# EAGLE design main (EAGLE 7.5.0)
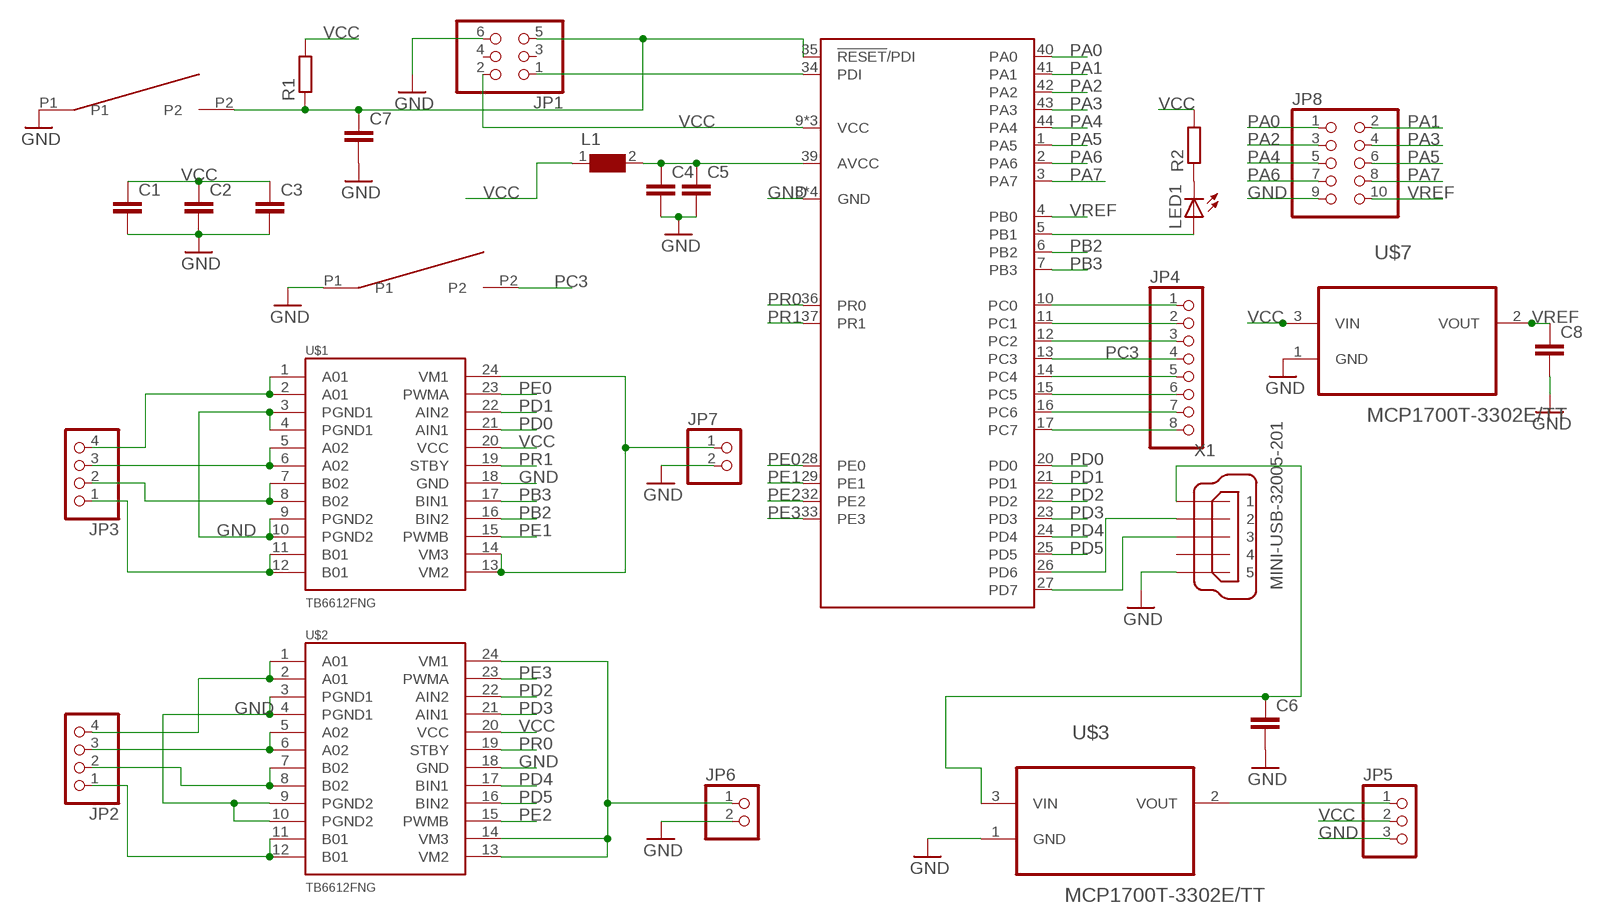
[diagram p0: schematic, sheet 1]

## Parts
C1  C-EUC0805  [C0805]
C2  C-EUC0805  [C0805]
C3  C-EUC0805  [C0805]
C4  C-EUC0805  [C0805]
C5  C-EUC0805  [C0805]
C6  C-EUC0805  [C0805]
C7  C-EUC0805  [C0805]
C8  C-EUC0805  [C0805]
JP1  PINHD-2X3  [2X03]
JP2  PINHD-1X4  [1X04]
JP3  PINHD-1X4  [1X04]
JP4  PINHD-1X8  [1X08]
JP5  PINHD-1X3  [1X03]
JP6  PINHD-1X2  [1X02]
JP7  PINHD-1X2  [1X02]
JP8  PINHD-2X5  [2X05]
L1  WE-CBF-74279202_0805  [0805]
LED1  LEDCHIP-LED0805  [CHIP-LED0805]
R1  R-EU_R0805  [R0805]
R2  R-EU_R0805  [R0805]
U1  ATXMEGA32C4-AU  [TQFP-44A-44]
U$1  TB6612FNG  [SSOP24]
U$2  TB6612FNG  [SSOP24]
U$3  MCP1700T-3302E/TT  [SOT95P237X112-3N]
U$4  SWITCH_2PIN_SMD  [SWITCH_2PIN_SMD]
U$6  SWITCH_2PIN_SMD  [SWITCH_2PIN_SMD]
U$7  MCP1700T-3302E/TT  [SOT95P237X112-3N]
X1  MINI-USB-32005-201  [32005-201]

## Nets
AO1_1: JP3.4 U$1.1(A01) U$1.2(A01)
AO1_2: JP2.4 U$2.1(A01) U$2.2(A01)
AO2_1: JP3.3 U$1.5(A02) U$1.6(A02)
AO2_2: JP2.3 U$2.5(A02) U$2.6(A02)
AVCC: C4.1 C5.1 L1.2 U1.39(AVCC)
BO1_1: JP3.1 U$1.11(B01) U$1.12(B01)
BO1_2: JP2.1 U$2.11(B01) U$2.12(B01)
BO2_1: JP3.2 U$1.7(B02) U$1.8(B02)
BO2_2: JP2.2 U$2.7(B02) U$2.8(B02)
GND: C1.2 C2.2 C3.2 C4.2 C5.2 C6.2 C7.2 C8.2 JP1.6 JP5.3 JP6.2 JP7.2 JP8.9 U1.8(GND) U1.18(GND) U1.30(GND) U1.38(GND) U$1.3(PGND1) U$1.4(PGND1) U$1.9(PGND2) U$1.10(PGND2) U$1.18(GND) U$2.3(PGND1) U$2.4(PGND1) U$2.9(PGND2) U$2.10(PGND2) U$2.18(GND) U$3.1(GND) U$4.P1 U$6.P1 U$7.1(GND) X1.5
N$1: JP1.1 U1.34(PDI)
N$2: LED1.C R2.1
N$3: C7.1 JP1.5 R1.1 U1.35(!RESET!/PDI) U$4.P2
N$4: JP4.6 U1.15(PC5)
N$5: JP4.5 U1.14(PC4)
N$6: U1.26(PD6) X1.2
N$7: U1.27(PD7) X1.3
N$8: C6.1 U$3.3(VIN) X1.1
N$12: JP5.1 U$3.2(VOUT)
N$18: LED1.A U1.5(PB1)
N$19: JP4.8 U1.17(PC7)
N$21: JP4.7 U1.16(PC6)
N$26: JP4.3 U1.12(PC2)
N$27: JP4.2 U1.11(PC1)
N$28: JP4.1 U1.10(PC0)
PA0: JP8.1 U1.40(PA0)
PA1: JP8.2 U1.41(PA1)
PA2: JP8.3 U1.42(PA2)
PA3: JP8.4 U1.43(PA3)
PA4: JP8.5 U1.44(PA4)
PA5: JP8.6 U1.1(PA5)
PA6: JP8.7 U1.2(PA6)
PA7: JP8.8 U1.3(PA7)
PB2: U1.6(PB2) U$1.16(BIN2)
PB3: U1.7(PB3) U$1.17(BIN1)
PC3: JP4.4 U1.13(PC3) U$6.P2
PD0: U1.20(PD0) U$1.21(AIN1)
PD1: U1.21(PD1) U$1.22(AIN2)
PD2: U1.22(PD2) U$2.22(AIN2)
PD3: U1.23(PD3) U$2.21(AIN1)
PD4: U1.24(PD4) U$2.17(BIN1)
PD5: U1.25(PD5) U$2.16(BIN2)
PE0: U1.28(PE0) U$1.23(PWMA)
PE1: U1.29(PE1) U$1.15(PWMB)
PE2: U1.32(PE2) U$2.15(PWMB)
PE3: U1.33(PE3) U$2.23(PWMA)
PR0: U1.36(PR0) U$2.19(STBY)
PR1: U1.37(PR1) U$1.19(STBY)
VCC: C1.1 C2.1 C3.1 JP1.2 JP5.2 L1.1 R1.2 R2.2 U1.9(VCC) U1.19(VCC) U1.31(VCC) U$1.20(VCC) U$2.20(VCC) U$7.3(VIN)
VCC_MOTOR2: JP6.1 U$2.13(VM2) U$2.14(VM3) U$2.24(VM1)
VCC_MOTOR_1: JP7.1 U$1.13(VM2) U$1.14(VM3) U$1.24(VM1)
VREF: C8.1 JP8.10 U1.4(PB0) U$7.2(VOUT)
Unconnected: JP1.3 JP1.4 X1.4

## Library data of the parts
C1-C8 = rcl:C-EU: CAPACITOR, European symbol
JP1 = pinhead:PINHD-2X3: PIN HEADER
JP2 JP3 = pinhead:PINHD-1X4: PIN HEADER
JP4 = pinhead:PINHD-1X8: PIN HEADER
JP5 = pinhead:PINHD-1X3: PIN HEADER
JP6 JP7 = pinhead:PINHD-1X2: PIN HEADER
JP8 = pinhead:PINHD-2X5: PIN HEADER
L1 = WE-CBF:WE-CBF: SMD EMI Suppression Ferrite Beads WE-CBF - Excellent anti-EMI properties - Low DC-restistance - Impedances till 3000 ohms - Rated current up to 6 A -- Reliable Ni-Sn electrodes -- Perfect as data lined filter and for uncoupling of distribution voltage; MPN: 74279202; OC_FARNELL: 1635711; OC_NEWARK: 08P2361; PACKAGE: IND-0805; SUPPLIER: Wuerth Elektronik
LED1 = led:LED: LED OSRAM: - CHIPLED LG R971, LG N971, LY N971, LG Q971, LY Q971, LO R971, LY R971 LH N974, LH R974 LS Q976, LO Q976, LY Q976 LO Q996 - Hyper CHIPLED LW Q18S LB Q993, LB Q99A, LB R99A - SideLED LS A670, LO A670, LY A670, LG A670, LP A670 LB A673, LV A673, LT A673, LW A673 LH A674 LY A675 LS A676, LA A676, LO A676, LY A676, LW A676 LS A679, LY A679, LG A679 - Hyper Micro SIDELED® LS Y876, LA Y876, LO Y876, LY Y876 LT Y87S - SmartLED LW L88C, LW L88S LB L89C, LB L89S, LG L890 LS L89K, LO L89K, LY L89K LS L896, LA L896, LO L896, LY L896 - TOPLED LS T670, LO T670, LY T670, LG T670, LP T670 LSG T670, LSP T670, LSY T670, LOP T670, LYG T670 LG T671, LOG T671, LSG T671 LB T673, LV T673, LT T673, LW T673 LH T674 LS T676, LA T676, LO T676, LY T676, LB T676, LH T676, LSB T676, LW T676 LB T67C, LV T67C, LT T67C, LS T67K, LO T67K, LY T67K, LW E67C LS E67B, LA E67B, LO E67B, LY E67B, LB E67C, LV E67C, LT E67C LW T67C LS T679, LY T679, LG T679 LS T770, LO T770, LY T770, LG T770, LP T770 LB T773, LV T773, LT T773, LW T773 LH T774 LS E675, LA E675, LY E675, LS T675 LS T776, LA T776, LO T776, LY T776, LB T776 LHGB T686 LT T68C, LB T68C - Hyper Mini TOPLED® LB M676 - Mini TOPLED Santana® LG M470 LS M47K, LO M47K, LY M47K Source: http://www.osram.convergy.de LUXEON: - LUMILED® LXK2-PW12-R00, LXK2-PW12-S00, LXK2-PW14-U00, LXK2-PW14-V00 LXK2-PM12-R00, LXK2-PM12-S00, LXK2-PM14-U00 LXK2-PE12-Q00, LXK2-PE12-R00, LXK2-PE12-S00, LXK2-PE14-T00, LXK2-PE14-U00 LXK2-PB12-K00, LXK2-PB12-L00, LXK2-PB12-M00, LXK2-PB14-N00, LXK2-PB14-P00, LXK2-PB14-Q00 LXK2-PR12-L00, LXK2-PR12-M00, LXK2-PR14-Q00, LXK2-PR14-R00 LXK2-PD12-Q00, LXK2-PD12-R00, LXK2-PD12-S00 LXK2-PH12-R00, LXK2-PH12-S00 LXK2-PL12-P00, LXK2-PL12-Q00, LXK2-PL12-R00 Source: www.luxeon.com KINGBRIGHT: KA-3528ASYC Source: www.kingbright.com
R1 R2 = resistor:R-EU_: RESISTOR, European symbol
U1 = atmega-atxmega:ATXMEGA32C4: 8/16-bit XMEGA C4 Microcontroller Features High-performance, low-power Atmel® AVR® XMEGA® 8/16-bit Microcontroller Nonvolatile program and data memories – 16K - 32KBytes of In-System Self-Programmable Flash – 4KBytes Boot Code Section with Independent Lock Bits – 1KBytes EEPROM – 2K - 4KBytes Internal SRAM Peripheral features – Four-channel event system – Four 16-bit timer/counters Three timer/counters with four output compare or input capture channels One timer/counter with two output compare or input capture channels High resolution extension on two timer/counters Advanced waveform extension (AWeX) on one timer/counter – One USB device interface USB 2.0 full speed (12Mbps) and low speed (1.5Mbps) device compliant 32 Endpoints with full configuration flexibility – Three USARTs with IrDA support for one USART – Two two-wire interfaces with dual address match (I2C and SMBus compatible) – Two serial peripheral interfaces (SPIs) – CRC-16 (CRC-CCITT) and CRC-32 (IEEE®802.3) generator – 16-bit real time counter (RTC) with separate oscillator – One sixteen-channel, 12-bit, 300ksps Analog to Digital Converter – Two Analog Comparators with window compare function, and current sources – External interrupts on all general purpose I/O pins – Programmable watchdog timer with separate on-chip ultra low power oscillator – QTouch® library support Capacitive touch buttons, sliders and wheels Special microcontroller features – Power-on reset and programmable brown-out detection – Internal and external clock options with PLL and prescaler – Programmable multilevel interrupt controller – Five sleep modes – Programming and debug interface PDI (program and debug interface) I/O and packages – 34 programmable I/O pins – 44-lead TQFP – 44-pad QFN – 49-ball VFBGA Operating voltage – 1.6 – 3.6V Operating frequency – 0 – 12MHz from 1.6V – 0 – 32MHz from 2.7V
U$1 U$2 = SparkFun-PowerIC:TB6612FNG: Toshiba 1A dual motor driver IC-09363; PROD_ID: IC-09363
U$3 U$7 = microchip_ldo:MCP1700T-3302E/TT: Low Quiescent Current LDO; MPN: MCP1700T-3302E/TT; OC_FARNELL: 1296592; OC_NEWARK: 88H9817; PACKAGE: SOT23-3; SUPPLIER: Microchip
U$4 U$6 = emile:SWITCH_2PIN_SMD
X1 = con-cypressindustries:MINI-USB-: MINI USB-B Conector Source: www.cypressindustries.com; OC_FARNELL: unknown; OC_NEWARK: unknown

## Board
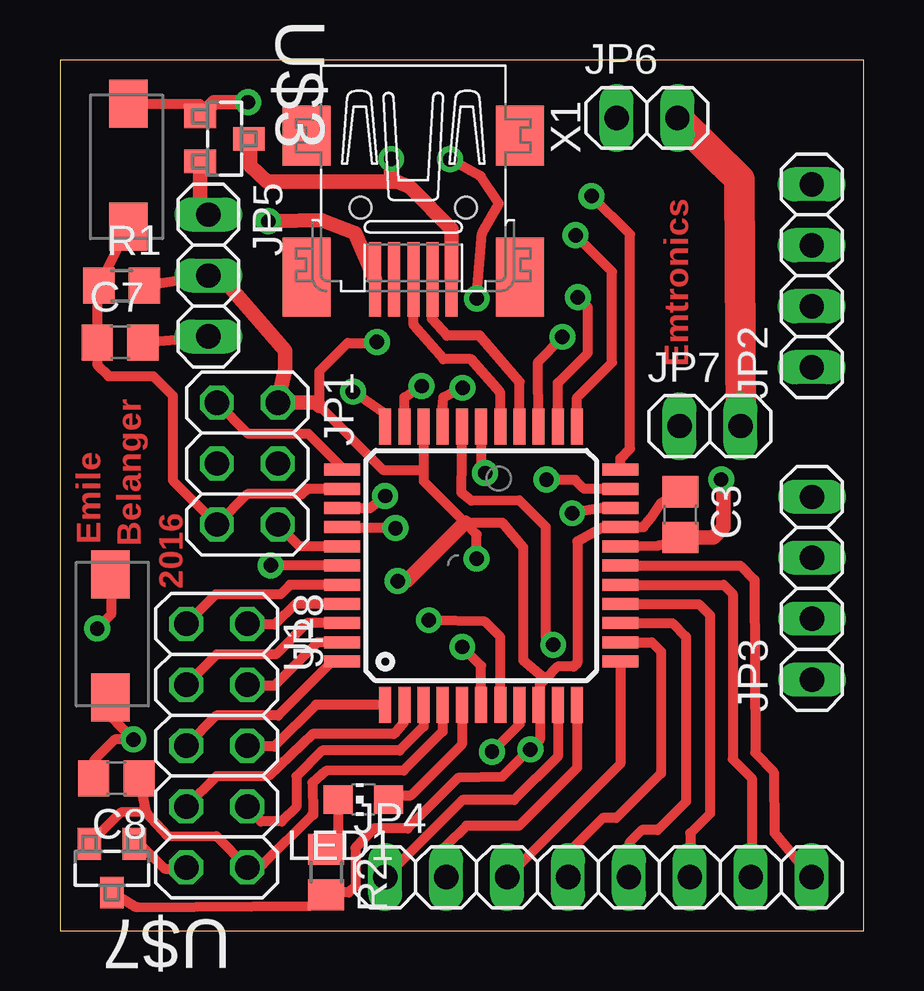
[diagram p1: board, top side]
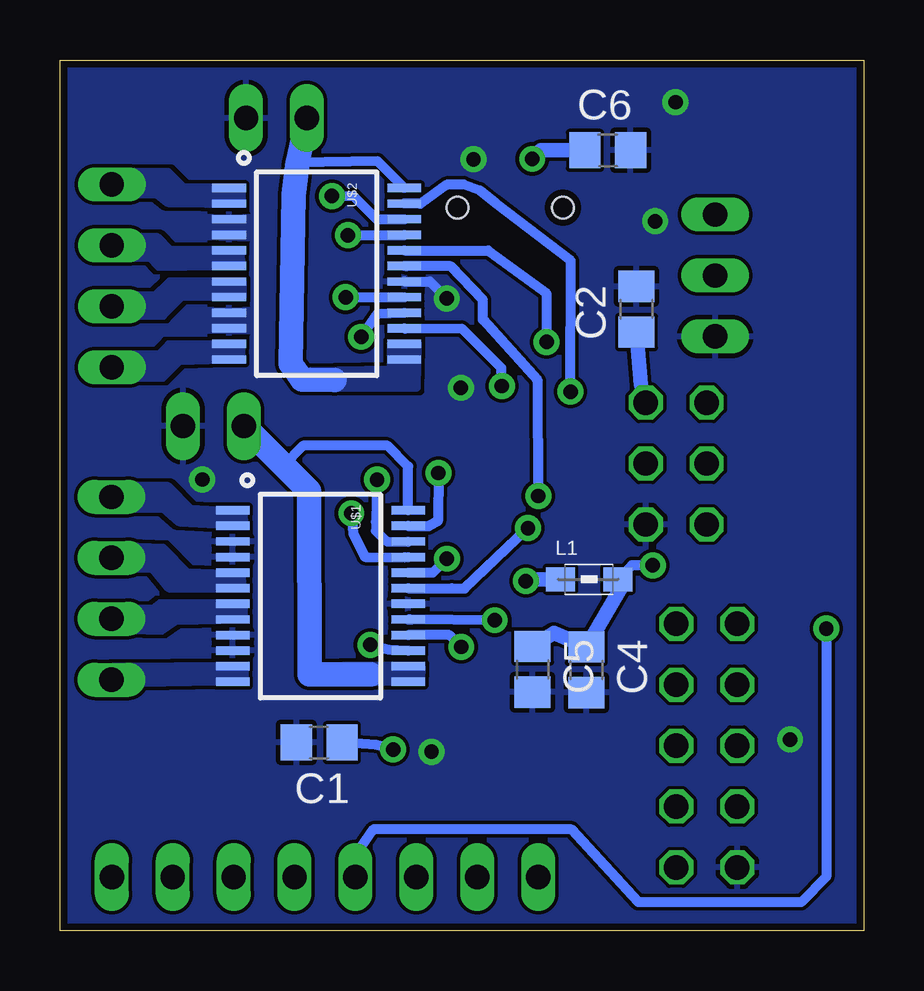
[diagram p2: board, bottom side, seen from below]

Size 33.5 x 36.3 mm. Coordinates in mm from the lower left corner, seen from the top.
Outline: 0,0 33.5,0 33.5,36.3 0,36.3 0,0
Copper layers (1*16): Top 0.035mm / dielectric 1.5mm / Bottom 0.035mm
Design rules "PCB-POOL Standard": minimum track width 0.15mm, minimum drill 0.3mm, track to track 0.15mm, track to pad 0.15mm, pad to pad 0.15mm, via to via 0.15mm, smd to smd 0.15mm, copper to edge 0.3mm, drill to drill 0.2mm, minimum pad ring 0.2mm, minimum via ring 0.15mm, stop-mask expansion 0.075mm, vias tented up to drill 0mil, thermal gap 0.2mm

### Footprints (pad centres in the part's own frame; a part is rotated, then mirrored left to right if it is on the bottom)
C0805 = smd 1.3 x 1.5: 1 -0.95,0; 2 0.95,0
2X03 = drill 1.016 octagon: 1 -2.54,-1.27; 2 -2.54,1.27; 3 0,-1.27; 4 0,1.27; 5 2.54,-1.27; 6 2.54,1.27
1X04 = drill 1.016 long: 1 -3.81,0; 2 -1.27,0; 3 1.27,0; 4 3.81,0
1X08 = drill 1.016 long: 1 -8.89,0; 2 -6.35,0; 3 -3.81,0; 4 -1.27,0; 5 1.27,0; 6 3.81,0; 7 6.35,0; 8 8.89,0
1X03 = drill 1.016 long: 1 -2.54,0; 2 0,0; 3 2.54,0
1X02 = drill 1.016 long: 1 -1.27,0; 2 1.27,0
2X05 = drill 1.016 octagon: 1 -5.08,-1.27; 2 -5.08,1.27; 3 -2.54,-1.27; 4 -2.54,1.27; 5 0,-1.27; 6 0,1.27; 7 2.54,-1.27; 8 2.54,1.27; 9 5.08,-1.27; 10 5.08,1.27
0805 = smd 1.2 x 1: 1 -1.2,0; 2 1.2,0
CHIP-LED0805 = smd 1.2 x 1.2: A 0,-1.05; C 0,1.05
R0805 = smd 1.3 x 1.5: 1 -0.95,0; 2 0.95,0
TQFP-44A-44 = smd 1.5 x 0.5: 1 -5.8,4; 2 -5.8,3.2; 3 -5.8,2.4; 4 -5.8,1.6; 5 -5.8,0.8; 6 -5.8,0; 7 -5.8,-0.8; 8 -5.8,-1.6; 9 -5.8,-2.4; 10 -5.8,-3.2; 11 -5.8,-4; 23 5.8,-4; 24 5.8,-3.2; 25 5.8,-2.4; 26 5.8,-1.6; 27 5.8,-0.8; 28 5.8,0; 29 5.8,0.8; 30 5.8,1.6; 31 5.8,2.4; 32 5.8,3.2; 33 5.8,4 | smd 0.5 x 1.5: 12 -4,-5.8; 13 -3.2,-5.8; 14 -2.4,-5.8; 15 -1.6,-5.8; 16 -0.8,-5.8; 17 0,-5.8; 18 0.8,-5.8; 19 1.6,-5.8; 20 2.4,-5.8; 21 3.2,-5.8; 22 4,-5.8; 34 4,5.8; 35 3.2,5.8; 36 2.4,5.8; 37 1.6,5.8; 38 0.8,5.8; 39 0,5.8; 40 -0.8,5.8; 41 -1.6,5.8; 42 -2.4,5.8; 43 -3.2,5.8; 44 -4,5.8
SSOP24 = smd 0.348 x 1.397: 1 -3.575,-3.656; 2 -2.925,-3.656; 3 -2.275,-3.656; 4 -1.625,-3.656; 5 -0.975,-3.656; 6 -0.325,-3.656; 7 0.325,-3.656; 8 0.975,-3.656; 9 1.625,-3.656; 10 2.275,-3.656; 11 2.925,-3.656; 12 3.575,-3.656; 13 3.575,3.656; 14 2.925,3.656; 15 2.275,3.656; 16 1.625,3.656; 17 0.975,3.656; 18 0.325,3.656; 19 -0.325,3.656; 20 -0.975,3.656; 21 -1.625,3.656; 22 -2.275,3.656; 23 -2.925,3.656; 24 -3.575,3.656
SOT95P237X112-3N = smd 0.991 x 1.321: 1 -0.94,-1.016; 2 0.94,-1.016; 3 0,1.016
SWITCH_2PIN_SMD = smd 2 x 1.6: P1 -2.631,0.075; P2 2.484,0.075
32005-201 = smd 3.1 x 0.5: 1 3,1.6; 2 3,0.8; 3 3,0; 4 3,-0.8; 5 3,-1.6 | smd 2.5 x 2: M1 -3,-4.45; M2 -3,4.45 | smd 3.3 x 2: M3 2.9,4.45; M4 2.9,-4.45 | hole 0.9: 0,2.2; 0,-2.2

### Placement (x,y rotation side)
C1  22.7,7.84 180 bottom
C2  9.47,25.91 90 bottom
C3  25.86,17.35 270 top
C4  11.55,10.88 270 bottom
C5  13.79,10.9 270 bottom
C6  10.66,32.53 0 bottom
C7  2.51,24.52 0 top
C8  2.36,6.36 180 top
JP1  7.81,19.48 270 top
JP2  31.34,27.3 90 top
JP3  31.35,14.27 90 top
JP4  22.45,2.24 0 top
JP5  6.19,27.31 270 top
JP6  24.47,33.88 0 top
JP7  27.1,21.04 0 top
JP8  6.54,7.72 270 top
L1  11.44,14.65 0 bottom
LED1  12.65,5.47 90 top
R1  2.57,26.89 0 top
R2  11.1,2.44 270 top
U1  17.56,15.22 90 top
U$1  22.64,13.95 270 bottom
U$2  22.79,27.39 270 bottom
U$3  6.86,33.01 270 top
U$4  2.78,31.84 270 top
U$6  2.18,12.36 90 top
U$7  2.17,2.61 180 top
X1  14.73,30.15 270 top

### Tracks (layer width: path | path; a pad name or v marks a point on that pad's centre or on a via)
AO1_1
  pour Bottom (no thermals): 26.6,17.46 28.04,17.54 28.99,18.49 31.11,18.49 31.11,17.65 29.18,17.65 28.52,17.06 25.84,16.92 25.86,17.46
AO1_2
  pour Bottom (no thermals): 26.48,30.93 28.34,30.93 29,31.58 31.28,31.58 31.33,30.76 29.43,30.73 29,30.38 25.94,30.33 25.96,30.88
AO2_1
  pour Bottom (no thermals): 25.95,14.82 28.21,14.9 29.2,15.92 31.22,16 31.16,15.15 29.64,15.12 28.97,14.31 25.9,14.3 25.95,14.72
AO2_2
  pour Bottom (no thermals): 26.73,28.33 28.93,28.36 29.43,28.86 31.43,28.86 31.43,28.11 29.72,28.09 29.35,27.71 25.97,27.77 25.99,28.31
AVCC  (via drill 0.6)
  Top 0.406: U1.39 v8.8,15.22 v8.79,15.23
  Bottom 0.406: v8.79,15.23 9.66,15.23 L1.2
  Bottom 0.61: L1.2 10.03,14.45 C4.1 12.91,12.41 C5.1
BO1_1
  pour Bottom (no thermals): 25.82,10.95 25.86,10.45 31.25,10.34 31.21,10.98 26.27,11.01
BO1_2
  pour Bottom (no thermals): 26.63,23.83 28.56,23.76 29.25,23.07 31.03,23.07 31.03,24 29.35,24 28.93,24.42 25.99,24.42 25.99,23.88
BO2_1
  pour Bottom (no thermals): 26.62,13.6 29.28,13.63 29.6,13.37 31.17,13.41 31.16,12.6 29.28,12.53 28.68,12.96 25.87,13.03 25.87,13.63
BO2_2
  pour Bottom (no thermals): 26.51,26.45 28.44,26.45 29.23,25.66 31.03,25.66 31.03,26.45 29.5,26.45 28.91,27.03 25.92,27.03 25.92,26.43
GND  (via drill 0.6)
  Top 0.406: U1.18 24.98,16.06 C3.2 | U1.8 19.16,8.61 v18.01,7.46 | U1.30 15.96,21.78 15.98,22.23 v16.78,22.63 | v17.37,26.36 17.6,29.07 18.3,30.32 17.54,31.46 v16.26,32.16 | U1.38 9.99,16.02 JP1.6 | U$4.P1 5.84,34.47 U$3.1 | C7.2 JP5.3 | U$6.P1 2.13,8.94 v3.06,7.97 2.29,7.97 1.44,7.12 1.44,6.39 C8.2 1.51,6.46 | U$7.1 3.43,3.52 4.36,2.59 5.22,2.59 JP8.9
  Top 0.61: X1.5 12.3,29.08 10.91,29.61 8.92,29.58 v8.69,29.58 | U$3.1 6.43,34.54 v7.83,34.54 | C3.2 27.24,16.4 27.65,16.81 27.65,18.73 v27.57,18.81
  Top 1.27: 28.39,21.02 28.32,31.33 25.8,33.82 25.75,33.87 JP6.2
  Bottom 0.406: U$2.18 18.08,27.06 v17.37,26.36
  Bottom 0.61: v7.83,34.54 7.87,34.57
  pour Bottom (rank 2): 35.94,37.66 -2.01,38.08 -2.3,-3.39 35.36,-3.51
  pour Bottom (no thermals): 26.48,25.77 27.67,25.81 27.64,25.11 25.32,25.06 25.29,25.81
  pour Bottom (no thermals): 26.48,29.65 27.67,29.69 27.64,28.99 25.32,28.94 25.29,29.69
N$1
  Top 0.406: U1.34 11.76,19.31 10.36,20.71 7.85,20.71 JP1.1
N$2
  Top 0.406: LED1.C 11.6,4.02 R2.1
N$3
  Top 0.406: U1.35 10.29,18.42 10.08,18.2 7.81,18.2 JP1.5 4.71,18.77 4.71,22.3 3.89,23.12 2.03,23.12 1.56,23.59 C7.1 1.56,26.89 R1.1 U$4.P2
N$4
  Top 0.406: U1.15 26.63,13.62 27.09,13.16 27.09,4.88 26.28,4.07 26.28,2.25 JP4.6
N$5
  Top 0.406: U1.14 25.53,12.82 26.1,12.25 26.1,5.38 24.92,4.2 24.26,4.2 23.74,3.68 23.74,2.26 JP4.5
N$6
  Top 0.406: U1.26 19.16,22.87 17.49,24.81 16.12,24.8 15.5,25.5 15.49,27.11 X1.2
N$7
  Top 0.406: U1.27 18.36,22.43 17.14,23.83 15.99,23.83 14.75,25.24 X1.3
N$8  (via drill 0.6)
  Top 0.61: X1.1 16.33,29.25 14.58,30.99 14.04,31.23 | 14.04,31.23 8.63,31.23 7.92,31.89 7.92,32.97 U$3.3 | v13.81,32.17 13.81,31.42 14.04,31.23
  Bottom 0.61: C6.1 13.45,32.53 v13.81,32.17
N$12
  Top 0.61: U$3.2 5.84,30.2 JP5.1
N$18
  Top 0.406: U1.5 16.76,7.77 14.61,5.63 13.86,5.63 LED1.A
N$19
  Top 0.406: U1.17 28.36,15.22 28.95,14.63 28.98,7.42 29.75,6.62 29.79,4.08 31.08,2.49 JP4.8
N$21
  Top 0.406: U1.16 27.67,14.42 28.05,14.04 28.05,7.15 28.84,6.36 28.84,2.28 JP4.7
N$26
  Top 0.406: U1.12 23.36,6.95 JP4.3
N$27
  Top 0.406: U1.11 21.56,6.8 19.14,4.38 16.94,4.38 16.1,3.54 JP4.2
N$28
  Top 0.406: U1.10 20.76,7.27 18.94,5.45 16.77,5.45 JP4.1
PA0
  Top 0.406: U1.40 9.59,14.42 9.19,14.03 6.5,14.03 JP8.1
PA1
  Top 0.406: U1.41 9.81,13.62 8.96,12.76 7.84,12.76 JP8.2
PA2
  Top 0.406: U1.42 10.3,12.82 9,11.52 6.53,11.52 JP8.3
PA3
  Top 0.406: U1.43 10.74,12.02 8.93,10.21 7.85,10.21 JP8.4
PA4
  Top 0.406: U1.44 11.35,11.22 9.1,8.97 6.52,8.97 JP8.5
PA5
  Top 0.406: U1.1 10.67,9.42 8.93,7.68 7.84,7.68 JP8.6
PA6
  Top 0.406: U1.2 14.36,8.74 13.92,8.21 10.53,8.21 8.67,6.44 6.53,6.44 JP8.7
PA7
  Top 0.406: U1.3 15.16,8.51 14.16,7.51 10.94,7.51 9.86,6.44 9.86,5.17 9.24,4.55 8.38,4.55 JP8.8
PB2  (via drill 0.6)
  Top 0.406: U1.6 17.56,11.05 v16.77,11.83
  Bottom 0.406: v16.77,11.83 17.26,12.33 U$1.16
PB3  (via drill 0.6)
  Top 0.406: U1.7 18.36,12.25 17.71,12.89 v15.37,12.95
  Bottom 0.406: v15.37,12.95 18.86,12.97 U$1.17
PC3  (via drill 0.6)
  Top 0.406: U1.13 24.67,12.02 25.06,11.64 25.06,6.56 23.2,4.7 22.63,4.7 21.2,3.27 21.2,2.26 JP4.4 | U$6.P2 2.13,13.18 v1.55,12.6
  Bottom 0.406: v1.55,12.6 1.55,2.24 2.6,1.2 9.39,1.2 12.17,4.23 20.44,4.23 21.2,3.15 21.2,2.26 JP4.4
PD0  (via drill 0.6)
  Top 0.406: U1.20 22.57,17.62 v21.35,17.41
  Bottom 0.406: v21.35,17.41 21.27,16.55 20.78,15.59 19.13,15.57 U$1.21
PD1  (via drill 0.6)
  Top 0.406: U1.21 21.85,18.42 21.47,18.8 20.29,18.8 v20.28,18.81
  Bottom 0.406: v20.28,18.81 20.33,17.04 20.33,16.67 19.88,16.23 19,16.21 U$1.22
PD2  (via drill 0.6)
  Top 0.406: U1.22 23.36,19.69 23.77,20.1 23.77,29.04 v22.16,30.63
  Bottom 0.406: v22.16,30.63 21.27,30.64 20.29,29.66 U$2.22
PD3  (via drill 0.6)
  Top 0.406: U1.23 21.56,22.23 23.01,23.69 23.01,27.48 v21.5,28.99
  Bottom 0.406: v21.5,28.99 19.16,28.99 U$2.21
PD4  (via drill 0.6)
  Top 0.406: U1.24 20.76,22.84 22.01,24.09 22.01,25.98 v21.59,26.41
  Bottom 0.406: v21.59,26.41 U$2.17
PD5  (via drill 0.6)
  Top 0.406: U1.25 19.93,23.71 v20.94,24.76
  Bottom 0.406: v20.94,24.76 20.27,25.72 U$2.16
PE0  (via drill 0.6)
  Top 0.406: U1.28 17.56,19.4 v17.73,19.08
  Bottom 0.406: v17.73,19.08 17.75,17.08 18.13,16.86 18.96,16.86 U$1.23
PE1  (via drill 0.6)
  Top 0.406: U1.29 16.72,18.28 17.16,17.93 19.14,17.95 20.24,16.85 20.24,12.25 v20.56,11.92
  Bottom 0.406: v20.56,11.92 19.8,11.72 U$1.15
PE2  (via drill 0.6)
  Top 0.406: U1.32 14.36,22.24 v15.08,22.71
  Bottom 0.406: v15.08,22.71 15.09,23.46 16.74,25.1 19.11,25.08 U$2.15
PE3  (via drill 0.6)
  Top 0.406: U1.33 13.58,21.53 v12.21,22.48
  Bottom 0.406: v12.21,22.48 12.2,27.93 15.34,30.33 15.99,30.86 16.68,31.11 17.38,31.09 18.48,30.3 U$2.23
PR0  (via drill 0.6)
  Top 0.406: U1.36 12.92,17.62 v13.56,18.12
  Bottom 0.406: v13.56,18.12 13.58,22.93 15.87,25.47 15.87,26.29 17.22,27.71 19.06,27.71 U$2.19
PR1  (via drill 0.6)
  Top 0.406: v13.99,16.79 11.79,16.79 U1.37
  Bottom 0.406: U$1.19 17.16,14.28 16.93,14.27 16.63,14.27 v13.99,16.79
VCC  (via drill 0.6)
  Top 0.406: 20.24,10.5 20.75,11.01 21.41,11.01 21.56,11.16 21.56,16.23 22.66,16.82 U1.19 24.33,16.82 24.63,17.21 25.04,17.82 C3.1 | 20.24,10.5 20,10.27 20,9.47 | 20,9.47 U1.9 | U1.31 15.16,19.2 | 15.16,19.2 15.16,18.74 16.89,17.01 | 16.89,17.01 18.43,17.01 19.3,15.98 19.3,11.28 20.24,10.5 | 15.16,19.2 15.14,19.21 13.47,19.21 10.82,21.86 10.82,23.32 11.99,24.5 13.17,24.5 v13.22,24.54 | v17.37,15.51 17.37,16.52 16.89,17.01 | 20,9.47 20,7.95 v19.61,7.56 19.57,7.56 18.43,6.42 16.59,6.37 14.49,4.27 13.08,4.27 12.32,3.46 12.32,1.88 12.03,1.59 11.07,1.59 R2.2 10.45,1.05 3.23,0.98 3.16,0.98 U$7.3 | R1.2 JP5.2
  Top 0.61: 10.82,21.86 10.67,22.02 JP1.2 9.38,23.39 9.38,24.19 6.68,27.31 JP5.2 | v14.08,14.58 14.46,14.58 16.89,17.01
  Bottom 0.406: U$1.20 17.95,14.93 v17.37,15.51 | U$2.20 15.65,28.36 13.22,26.58 13.22,24.58 v13.22,24.54 | v19.61,7.56 20.34,7.75 C1.1
  Bottom 0.61: JP1.2 9.29,22.77 C2.1 | L1.1 14,14.65 v14.08,14.58
VCC_MOTOR2
  Bottom 0.406: U$2.24 20.25,32.08 23.59,32.03
  Bottom 1.016: JP6.1 23.59,32.03 23.76,30.66 23.89,23.65 23.4,22.98 22.04,22.96
  pour Bottom (no thermals): 18.61,24.44 19.69,24.42 19.69,23.35 23.06,23.28 23.1,22.68 18.65,22.68
VCC_MOTOR_1
  Bottom 0.406: U$1.24 18.98,19.36 19.84,20.22 23.36,20.22 24.19,19.39
  Bottom 1.016: JP7.1 24.19,19.39 23.11,18.32 23.09,10.68 20.53,10.68
  pour Bottom (no thermals): 18.99,11 21.66,11.01 21.64,10.39 18.46,10.43 18.45,10.98
VREF
  Top 0.406: U1.4 15.96,8.31 14.32,6.68 11.08,6.65 10.53,6.18 10.55,4.82 10.51,4.82 8.45,2.76 7.93,2.76 JP8.10 6.52,3.94 4.49,3.95 3.58,4.96 | C8.1 3.58,4.96 | 3.58,4.96 2.53,4.93 U$7.2

### Text on the board
Top: Emtronics | Emile | Belanger | 2016